# EAGLE design mainboard (EAGLE 6.4)
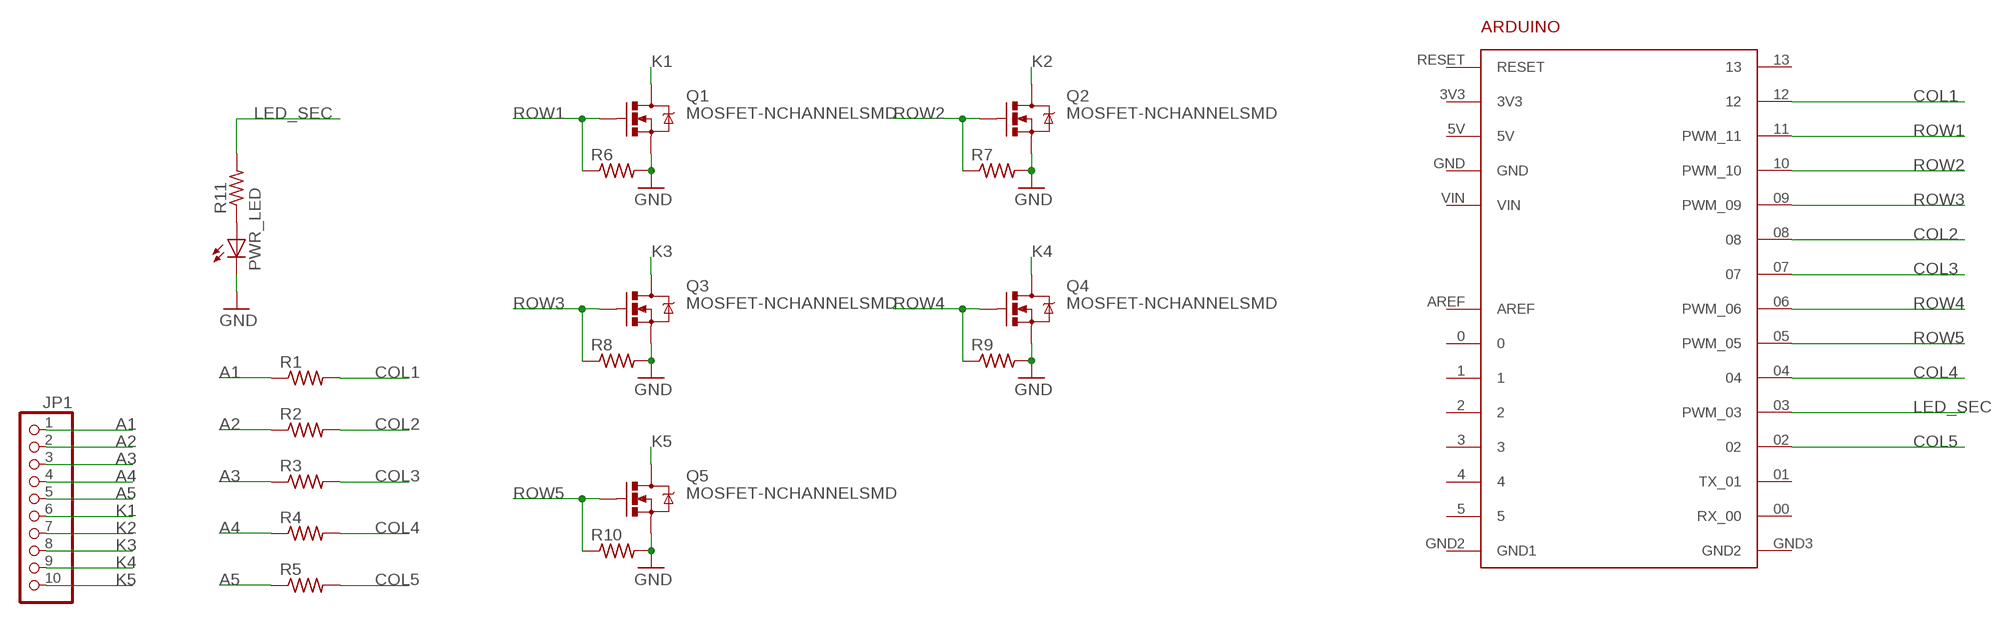
[diagram p0: schematic, sheet 1]

## Parts
ARDUINO1  ARDUINO  [ARDUINO]
JP1  PINHD-1X10  [1X10]
PWR_LED  LED5MM  [LED5MM]
Q1  MOSFET-NCHANNELSMD  [SOT23-3]
Q2  MOSFET-NCHANNELSMD  [SOT23-3]
Q3  MOSFET-NCHANNELSMD  [SOT23-3]
Q4  MOSFET-NCHANNELSMD  [SOT23-3]
Q5  MOSFET-NCHANNELSMD  [SOT23-3]
R1  R-US_M1206  [M1206]
R2  R-US_M1206  [M1206]
R3  R-US_M1206  [M1206]
R4  R-US_M1206  [M1206]
R5  R-US_M1206  [M1206]
R6  R-US_M1206  [M1206]
R7  R-US_M1206  [M1206]
R8  R-US_M1206  [M1206]
R9  R-US_M1206  [M1206]
R10  R-US_M1206  [M1206]
R11  R-US_M1206  [M1206]

## Nets
A1: JP1.1 R1.1
A2: JP1.2 R2.1
A3: JP1.3 R3.1
A4: JP1.4 R4.1
A5: JP1.5 R5.1
COL1: ARDUINO1.12 R1.2
COL2: ARDUINO1.08 R2.2
COL3: ARDUINO1.07 R3.2
COL4: ARDUINO1.04 R4.2
COL5: ARDUINO1.02 R5.2
GND: PWR_LED.K(C) Q1.2(S) Q2.2(S) Q3.2(S) Q4.2(S) Q5.2(S) R6.2 R7.2 R8.2 R9.2 R10.2
K1: JP1.6 Q1.3(D)
K2: JP1.7 Q2.3(D)
K3: JP1.8 Q3.3(D)
K4: JP1.9 Q4.3(D)
K5: JP1.10 Q5.3(D)
LED_SEC: ARDUINO1.03(PWM_03) R11.2
N$1: PWR_LED.A R11.1
ROW1: ARDUINO1.11(PWM_11) Q1.1(G) R6.1
ROW2: ARDUINO1.10(PWM_10) Q2.1(G) R7.1
ROW3: ARDUINO1.09(PWM_09) Q3.1(G) R8.1
ROW4: ARDUINO1.06(PWM_06) Q4.1(G) R9.1
ROW5: ARDUINO1.05(PWM_05) Q5.1(G) R10.1
Unconnected: ARDUINO1.0 ARDUINO1.00(RX_00) ARDUINO1.1 ARDUINO1.01(TX_01) ARDUINO1.2 ARDUINO1.3 ARDUINO1.4 ARDUINO1.5 ARDUINO1.13 ARDUINO1.AREF ARDUINO1.RESET

## Power pins joined to a net without a drawn wire
3V3: ARDUINO1.3V3
5V: ARDUINO1.5V
GND: ARDUINO1.GND
GND1: ARDUINO1.GND2(GND1)
GND2: ARDUINO1.GND3(GND2)
VIN: ARDUINO1.VIN

## Library data of the parts
ARDUINO1 = arduino:ARDUINO: For creating Arduino shields
JP1 = pinhead:PINHD-1X10: PIN HEADER
PWR_LED = led:LED: LED OSRAM: - CHIPLED LG R971, LG N971, LY N971, LG Q971, LY Q971, LO R971, LY R971 LH N974, LH R974 LS Q976, LO Q976, LY Q976 LO Q996 - Hyper CHIPLED LW Q18S LB Q993, LB Q99A, LB R99A - SideLED LS A670, LO A670, LY A670, LG A670, LP A670 LB A673, LV A673, LT A673, LW A673 LH A674 LY A675 LS A676, LA A676, LO A676, LY A676, LW A676 LS A679, LY A679, LG A679 - Hyper Micro SIDELED® LS Y876, LA Y876, LO Y876, LY Y876 LT Y87S - SmartLED LW L88C, LW L88S LB L89C, LB L89S, LG L890 LS L89K, LO L89K, LY L89K LS L896, LA L896, LO L896, LY L896 - TOPLED LS T670, LO T670, LY T670, LG T670, LP T670 LSG T670, LSP T670, LSY T670, LOP T670, LYG T670 LG T671, LOG T671, LSG T671 LB T673, LV T673, LT T673, LW T673 LH T674 LS T676, LA T676, LO T676, LY T676, LB T676, LH T676, LSB T676, LW T676 LB T67C, LV T67C, LT T67C, LS T67K, LO T67K, LY T67K, LW E67C LS E67B, LA E67B, LO E67B, LY E67B, LB E67C, LV E67C, LT E67C LW T67C LS T679, LY T679, LG T679 LS T770, LO T770, LY T770, LG T770, LP T770 LB T773, LV T773, LT T773, LW T773 LH T774 LS E675, LA E675, LY E675, LS T675 LS T776, LA T776, LO T776, LY T776, LB T776 LHGB T686 LT T68C, LB T68C - Hyper Mini TOPLED® LB M676 - Mini TOPLED Santana® LG M470 LS M47K, LO M47K, LY M47K Source: http://www.osram.convergy.de LUXEON: - LUMILED® LXK2-PW12-R00, LXK2-PW12-S00, LXK2-PW14-U00, LXK2-PW14-V00 LXK2-PM12-R00, LXK2-PM12-S00, LXK2-PM14-U00 LXK2-PE12-Q00, LXK2-PE12-R00, LXK2-PE12-S00, LXK2-PE14-T00, LXK2-PE14-U00 LXK2-PB12-K00, LXK2-PB12-L00, LXK2-PB12-M00, LXK2-PB14-N00, LXK2-PB14-P00, LXK2-PB14-Q00 LXK2-PR12-L00, LXK2-PR12-M00, LXK2-PR14-Q00, LXK2-PR14-R00 LXK2-PD12-Q00, LXK2-PD12-R00, LXK2-PD12-S00 LXK2-PH12-R00, LXK2-PH12-S00 LXK2-PL12-P00, LXK2-PL12-Q00, LXK2-PL12-R00 Source: www.luxeon.com KINGBRIGHT: KA-3528ASYC Source: www.kingbright.com
Q1-Q5 = SparkFun:MOSFET-NCHANNEL
R1-R11 = rcl:R-US_: RESISTOR, American symbol

## Board
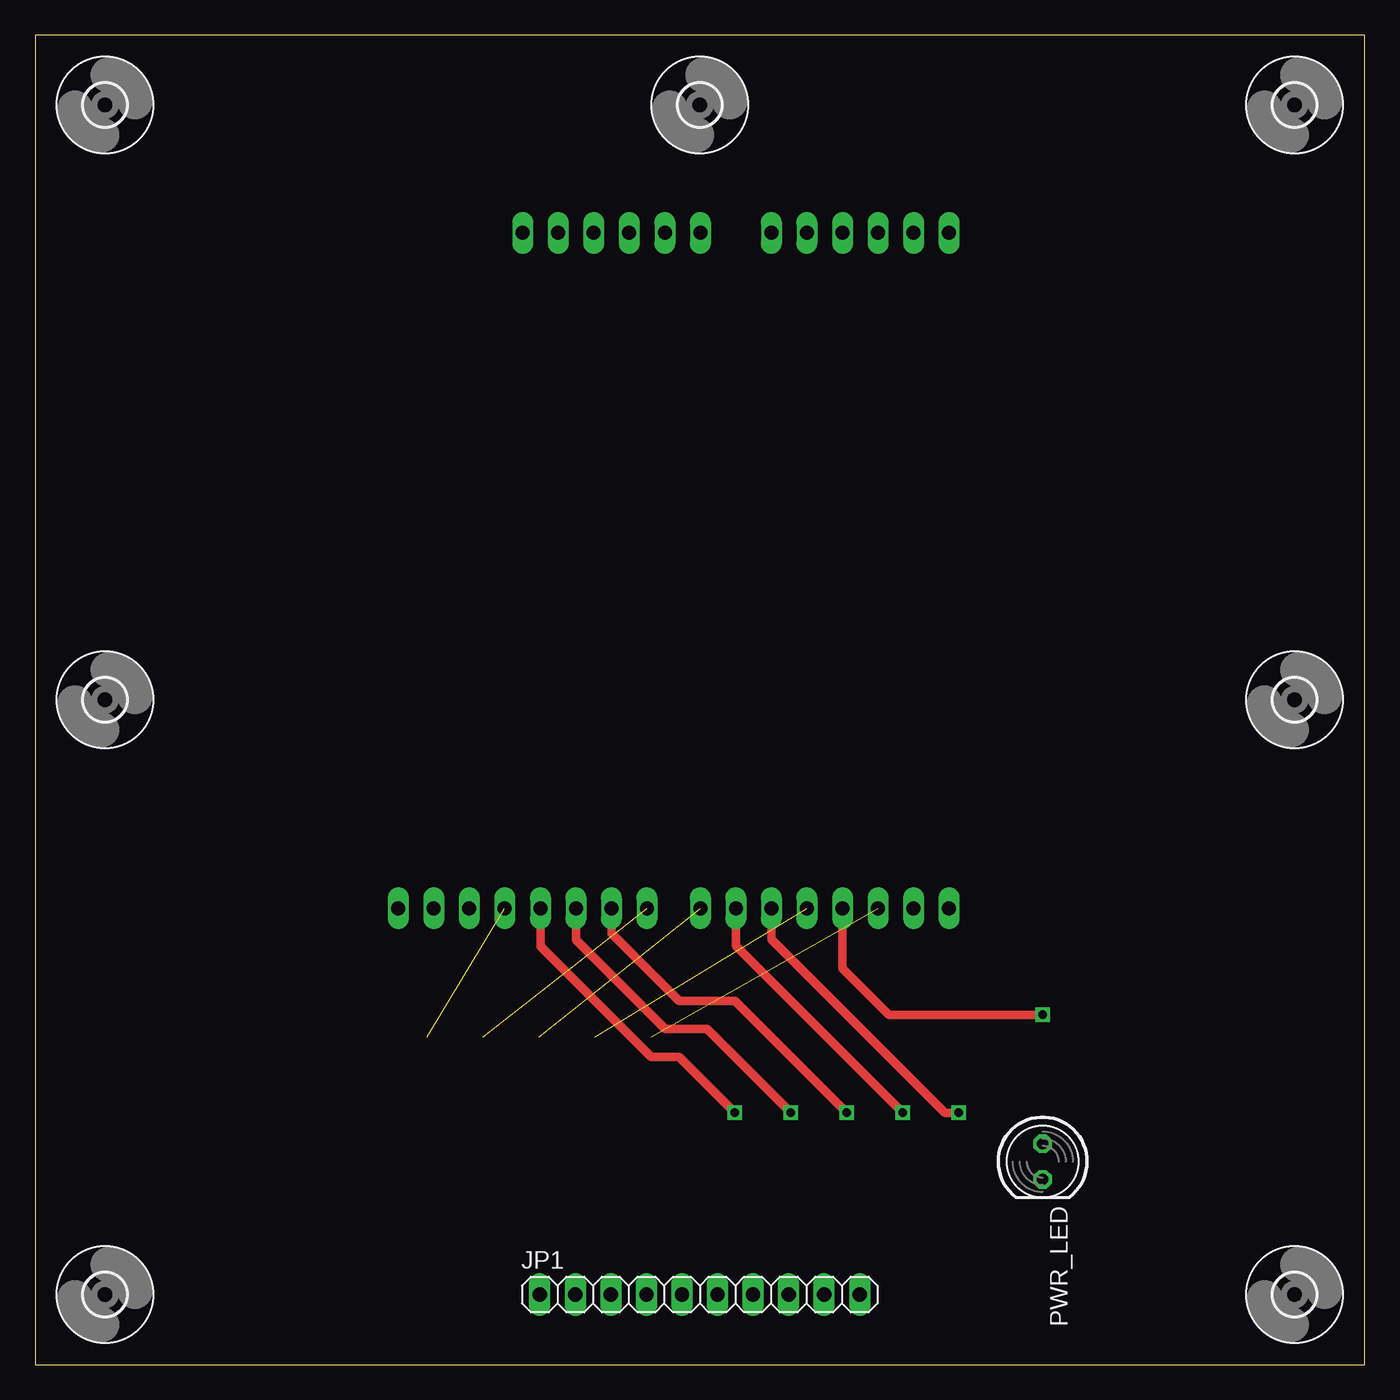
[diagram p1: board, top side]
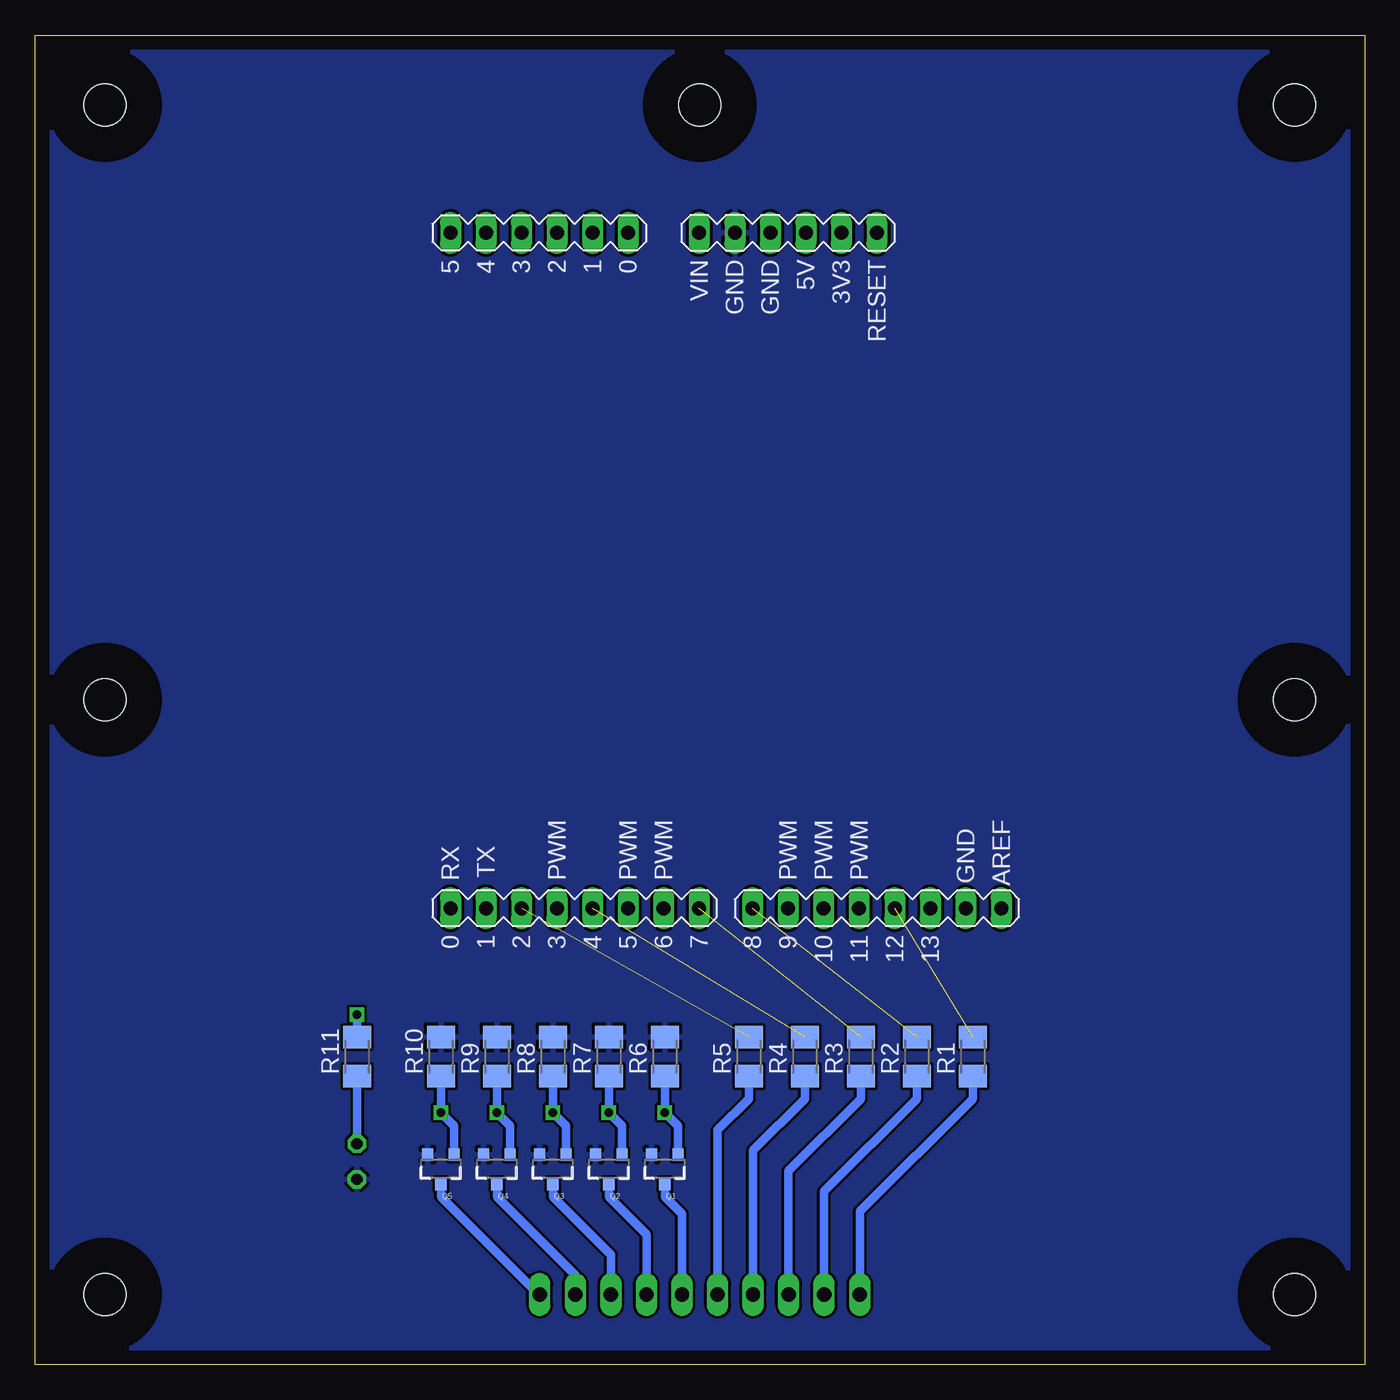
[diagram p2: board, bottom side, seen from below]

Size 95 x 95 mm. Coordinates in mm from the lower left corner, seen from the top.
Outline: 0,0 95,0 95,95 0,95 0,0
Copper layers (1*16): Top 0.035mm / dielectric 1.5mm / Bottom 0.035mm
Design rules "default": minimum track width 10mil, minimum drill 24mil, track to track 8mil, track to pad 8mil, pad to pad 8mil, via to via 8mil, smd to smd 8mil, copper to edge 40mil, drill to drill 8mil, minimum pad ring 10mil, minimum via ring 8mil, stop-mask expansion 4mil, vias tented up to drill 0mil, thermal gap 10mil

### Footprints (pad centres in the part's own frame; a part is rotated, then mirrored left to right if it is on the bottom)
ARDUINO = drill 1 long: 00 25.4,-20.32; 0 -22.86,-7.62; 01 25.4,-17.78; 1 -22.86,-10.16; 02 25.4,-15.24; 2 -22.86,-12.7; 03 25.4,-12.7; 3 -22.86,-15.24; 3V3 -22.86,7.62; 04 25.4,-10.16; 4 -22.86,-17.78; 05 25.4,-7.62; 5 -22.86,-20.32; 5V -22.86,5.08; 06 25.4,-5.08; 07 25.4,-2.54; 08 25.4,1.27; 09 25.4,3.81; 10 25.4,6.35; 11 25.4,8.89; 12 25.4,11.43; 13 25.4,13.97; AREF 25.4,19.05; GND -22.86,0; GND2 -22.86,2.54; GND3 25.4,16.51; RESET -22.86,10.16; VIN -22.86,-2.54
1X10 = drill 1.016 long: 1 -11.43,0; 2 -8.89,0; 3 -6.35,0; 4 -3.81,0; 5 -1.27,0; 6 1.27,0; 7 3.81,0; 8 6.35,0; 9 8.89,0; 10 11.43,0
LED5MM = drill 0.813 octagon: A -1.27,0; K 1.27,0
SOT23-3 = smd 0.8 x 0.9: 1 -0.95,-1; 2 0.95,-1; 3 0,1.1
M1206 = smd 1.6 x 2: 1 -1.4,0; 2 1.4,0
3,0 = hole 3: 0,0

### Placement (x,y rotation side)
ARDUINO1  45,58 270 bottom
JP1  47.5,5 0 top
PWR_LED  72,14.5 270 top
Q1  50,14 180 bottom
Q2  54,14 180 bottom
Q3  58,14 180 bottom
Q4  62,14 180 bottom
Q5  66,14 180 bottom
R1  28,22 90 bottom
R2  32,22 90 bottom
R3  36,22 90 bottom
R4  40,22 90 bottom
R5  44,22 90 bottom
R6  50,22 90 bottom
R7  54,22 90 bottom
R8  58,22 90 bottom
R9  62,22 90 bottom
R10  66,22 90 bottom
R11  72,22 90 bottom
U$1  [3,0]  5,47.5 0 top
U$2  [3,0]  90,47.5 0 top
U$3  [3,0]  47.5,90 0 top
U$4  [3,0]  5,90 0 top
U$5  [3,0]  90,90 0 top
U$6  [3,0]  90,5 0 top
U$7  [3,0]  5,5 0 top

### Tracks (layer width: path | path; a pad name or v marks a point on that pad's centre or on a via)
A1
  Bottom 0.61: JP1.1 36.07,10.93 28,19 R1.1
A2
  Bottom 0.61: JP1.2 38.61,12.39 32,19 R2.1
A3
  Bottom 0.61: JP1.3 41.15,13.85 36,19 R3.1
A4
  Bottom 0.61: JP1.4 43.69,15.31 40,19 R4.1
A5
  Bottom 0.61: JP1.5 46.23,16.77 44,19 R5.1
COL1  (1 unrouted)
COL2  (1 unrouted)
COL3  (1 unrouted)
COL4  (1 unrouted)
COL5  (1 unrouted)
GND
  pour Bottom: 0,-1 96,-1 96,96 -2,96 -2,-1
K1
  Bottom 0.61: JP1.6 48.77,10.77 50,12 Q1.3
K2
  Bottom 0.61: JP1.7 51.31,9.31 54,12 Q2.3
K3
  Bottom 0.61: JP1.8 53.85,7.85 58,12 Q3.3
K4
  Bottom 0.61: JP1.9 56.39,6.39 62,12 Q4.3
K5
  Bottom 0.61: JP1.10 59,5 66,12 Q5.3
LED_SEC  (via drill 0.6)
  Top 0.61: v72,25 61,25 57.7,28.3 ARDUINO1.03
  Bottom 0.61: R11.2 v72,25
N$1
  Bottom 0.61: R11.1 PWR_LED.A
ROW1  (via drill 0.6)
  Top 0.61: v50,18 46,22 44,22 36.11,29.89 ARDUINO1.11
  Bottom 0.61: Q1.1 49.05,17.05 v50,18 R6.1
ROW2  (via drill 0.6)
  Top 0.61: v54,18 48,24 45,24 38.65,30.35 ARDUINO1.10
  Bottom 0.61: Q2.1 53.05,17.05 v54,18 R7.1
ROW3  (via drill 0.6)
  Top 0.61: v58,18 50,26 46,26 41.19,30.81 ARDUINO1.09
  Bottom 0.61: Q3.1 57.05,17.05 v58,18 R8.1
ROW4  (via drill 0.6)
  Top 0.61: v62,18 50.08,29.92 ARDUINO1.06
  Bottom 0.61: Q4.1 61.05,17.05 v62,18 R9.1
ROW5  (via drill 0.6)
  Top 0.61: v66,18 65,18 52.62,30.38 ARDUINO1.05
  Bottom 0.61: Q5.1 65.05,17.05 v66,18 R10.1